# EAGLE schematic ds7_redraw (EAGLE 8.5.1)
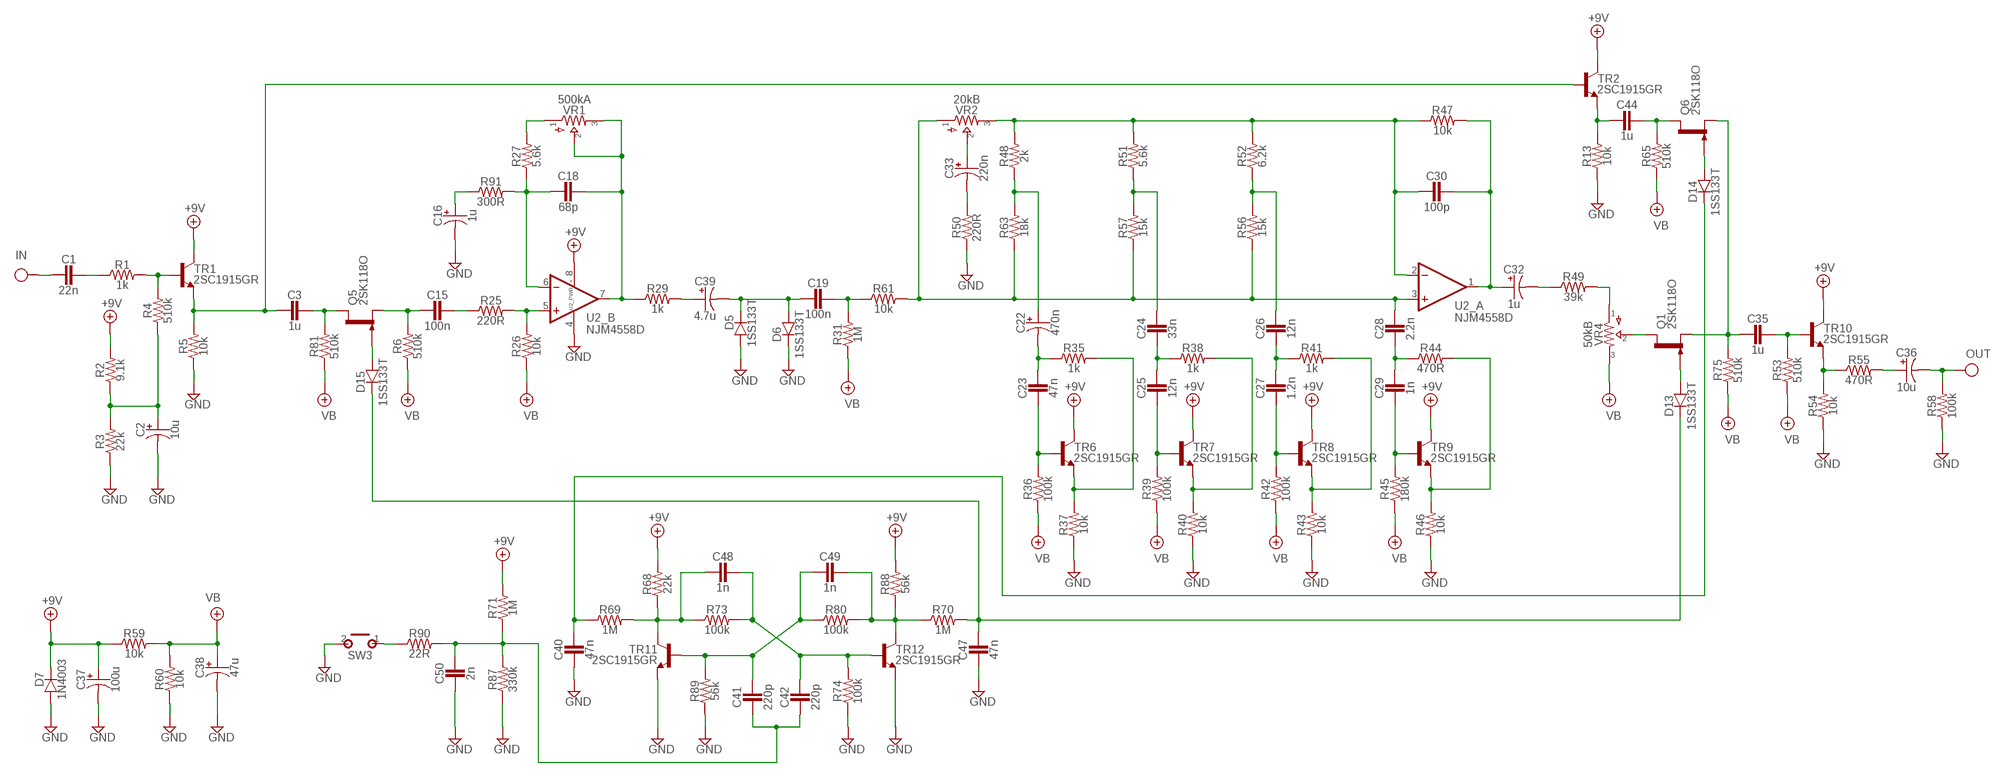
[diagram p0: schematic, sheet 1]

## Parts
C1  22n  CER/FILMBOX.1  [BOX_SMALL]
C2  10u  0400  [040_020]
C3  1u  CER/FILMBOX.1  [BOX_SMALL]
C15  100n  CER/FILMBOX.1  [BOX_SMALL]
C16  1u  0400  [040_020]
C18  68p  CER/FILMBOX.1  [BOX_SMALL]
C19  100n  CER/FILMBOX.1  [BOX_SMALL]
C22  470n  0400  [040_020]
C23  47n  CER/FILMBOX.1  [BOX_SMALL]
C24  33n  CER/FILMBOX.1  [BOX_SMALL]
C25  12n  CER/FILMBOX.1  [BOX_SMALL]
C26  12n  CER/FILMBOX.1  [BOX_SMALL]
C27  1.2n  CER/FILMBOX.1  [BOX_SMALL]
C28  2.2n  CER/FILMBOX.1  [BOX_SMALL]
C29  1n  CER/FILMBOX.1  [BOX_SMALL]
C30  100p  CER/FILMBOX.1  [BOX_SMALL]
C32  1u  0400  [040_020]
C33  220n  0400  [040_020]
C35  1u  CER/FILMBOX.1  [BOX_SMALL]
C36  10u  0400  [040_020]
C37  100u  0400  [040_020]
C38  47u  0400  [040_020]
C39  4.7u  0400  [040_020]
C40  47n  CER/FILMBOX.1  [BOX_SMALL]
C41  220p  CER/FILMBOX.1  [BOX_SMALL]
C42  220p  CER/FILMBOX.1  [BOX_SMALL]
C44  1u  CER/FILMBOX.1  [BOX_SMALL]
C47  47n  CER/FILMBOX.1  [BOX_SMALL]
C48  1n  CER/FILMBOX.1  [BOX_SMALL]
C49  1n  CER/FILMBOX.1  [BOX_SMALL]
C50  2n  CER/FILMBOX.1  [BOX_SMALL]
D5  1SS133T  DO41.2  [DO41-2]
D6  1SS133T  DO41.2  [DO41-2]
D7  1N4003  DO41.2  [DO41-2]
D13  1SS133T  DO41.2  [DO41-2]
D14  1SS133T  DO41.2  [DO41-2]
D15  1SS133T  DO41.2  [DO41-2]
Q1  2SK118O  2N5457  [TO92-]
Q5  2SK118O  2N5457  [TO92-]
Q6  2SK118O  2N5457  [TO92-]
R1  1k  R_.3B  [R0207/3]
R2  9.1k  R_.3B  [R0207/3]
R3  22k  R_.3B  [R0207/3]
R4  510k  R_.3B  [R0207/3]
R5  10k  R_.3B  [R0207/3]
R6  510k  R_.3B  [R0207/3]
R13  10k  R_.3B  [R0207/3]
R25  220R  R_.3B  [R0207/3]
R26  10k  R_.3B  [R0207/3]
R27  5.6k  R_.3B  [R0207/3]
R29  1k  R_.3B  [R0207/3]
R31  1M  R_.3B  [R0207/3]
R35  1k  R_.3B  [R0207/3]
R36  100k  R_.3B  [R0207/3]
R37  10k  R_.3B  [R0207/3]
R38  1k  R_.3B  [R0207/3]
R39  100k  R_.3B  [R0207/3]
R40  10k  R_.3B  [R0207/3]
R41  1k  R_.3B  [R0207/3]
R42  100k  R_.3B  [R0207/3]
R43  10k  R_.3B  [R0207/3]
R44  470R  R_.3B  [R0207/3]
R45  180k  R_.3B  [R0207/3]
R46  10k  R_.3B  [R0207/3]
R47  10k  R_.3B  [R0207/3]
R48  2k  R_.3B  [R0207/3]
R49  39k  R_.3B  [R0207/3]
R50  220R  R_.3B  [R0207/3]
R51  5.6k  R_.3B  [R0207/3]
R52  6.2k  R_.3B  [R0207/3]
R53  510k  R_.3B  [R0207/3]
R54  10k  R_.3B  [R0207/3]
R55  470R  R_.3B  [R0207/3]
R56  15k  R_.3B  [R0207/3]
R57  15k  R_.3B  [R0207/3]
R58  100k  R_.3B  [R0207/3]
R59  10k  R_.3B  [R0207/3]
R60  10k  R_.3B  [R0207/3]
R61  10k  R_.3B  [R0207/3]
R63  18k  R_.3B  [R0207/3]
R65  510k  R_.3B  [R0207/3]
R68  22k  R_.3B  [R0207/3]
R69  1M  R_.3B  [R0207/3]
R70  1M  R_.3B  [R0207/3]
R71  1M  R_.3B  [R0207/3]
R73  100k  R_.3B  [R0207/3]
R74  100k  R_.3B  [R0207/3]
R75  510k  R_.3B  [R0207/3]
R80  100k  R_.3B  [R0207/3]
R81  510k  R_.3B  [R0207/3]
R87  330k  R_.3B  [R0207/3]
R88  56k  R_.3B  [R0207/3]
R89  56k  R_.3B  [R0207/3]
R90  22R  R_.3B  [R0207/3]
R91  300R  R_.3B  [R0207/3]
SW3  MOMENTARY  [SPST]
TR1  2SC1915GR  2SC828A  [TO92-]
TR2  2SC1915GR  2SC828A  [TO92-]
TR6  2SC1915GR  2SC828A  [TO92-]
TR7  2SC1915GR  2SC828A  [TO92-]
TR8  2SC1915GR  2SC828A  [TO92-]
TR9  2SC1915GR  2SC828A  [TO92-]
TR10  2SC1915GR  2SC828A  [TO92-]
TR11  2SC1915GR  2SC828A  [TO92-]
TR12  2SC1915GR  2SC828A  [TO92-]
U2  NJM4558D  DUALTH  [DIL0]
VR1  500kA  POTS16MM  [16MM]
VR2  20kB  POTS16MM  [16MM]
VR4  50kB  POTS16MM  [16MM]

## Nets
+9V: C37.+ D7.C R2.2 R59.1 R68.2 R71.2 R88.2 TR1.2(C) TR2.2(C) TR6.2(C) TR7.2(C) TR8.2(C) TR9.2(C) TR10.2(C) U2.8(_PWR:V+)
GND: C2.- C16.- C37.- C38.- C40.2 C47.2 C50.2 D5.A D6.C D7.A R3.1 R5.1 R13.1 R37.1 R40.1 R43.1 R46.1 R50.1 R54.1 R58.1 R60.1 R74.1 R87.1 R89.1 SW3.2(S) TR11.3(E) TR12.3(E) U2.4(_PWR:V-)
IN: C1.2
N$1: C1.1 R1.1
N$2: R1.2 R4.2 TR1.1(B)
N$3: C3.2 R5.2 TR1.3(E) TR2.1(B)
N$4: C2.+ R2.1 R3.2 R4.1
N$5: C3.1 Q5.3(D) R81.2
N$6: D15.A Q5.1(G)
N$7: C15.2 Q5.2(S) R6.2
N$8: C15.1 R25.1
N$9: R25.2 R26.2 U2.5(_B:+IN)
N$10: C18.2 R27.1 R91.2 U2.6(_B:-IN)
N$11: C18.1 R29.1 U2.7(_B:OUT) VR1.2 VR1.3
N$12: R27.2 VR1.1
N$13: C16.+ R91.1
N$14: C39.+ R29.2
N$15: C19.2 C39.- D5.C D6.A
N$16: C19.1 R31.2 R61.1
N$17: C28.1 R56.1 R57.1 R61.2 R63.1 U2.3(_A:+IN) VR2.1
N$18: C33.+ VR2.2
N$19: C33.- R50.2
N$20: C30.2 R47.1 R48.2 R51.2 R52.2 U2.2(_A:-IN) VR2.3
N$21: C22.+ R48.1 R63.2
N$22: C22.- C23.1 R35.1
N$23: C23.2 R36.2 TR6.1(B)
N$24: R35.2 R37.2 TR6.3(E)
N$27: C24.1 R51.1 R57.2
N$28: C24.2 C25.1 R38.1
N$29: C48.2 R68.1 R69.2 R73.1 TR11.2(C)
N$30: C25.2 R39.2 TR7.1(B)
N$31: C49.1 R70.1 R80.2 R88.1 TR12.2(C)
N$32: C41.1 C49.2 R80.1 R89.2 TR11.1(B)
N$33: R38.2 R40.2 TR7.3(E)
N$34: C42.1 C48.1 R73.2 R74.2 TR12.1(B)
N$35: C26.1 R52.1 R56.2
N$36: C41.2 C42.2 C50.1 R71.1 R87.2 R90.2
N$37: C26.2 C27.1 R41.1
N$38: R90.1 SW3.1(P)
N$39: C27.2 R42.2 TR8.1(B)
N$40: R41.2 R43.2 TR8.3(E)
N$41: C28.2 C29.1 R44.1
N$42: C29.2 R45.2 TR9.1(B)
N$43: R44.2 R46.2 TR9.3(E)
N$44: C32.- R49.1
N$45: C30.1 C32.+ R47.2 U2.1(_A:OUT)
N$46: R49.2 VR4.1
N$47: C44.2 R13.2 TR2.3(E)
N$48: C44.1 Q6.3(D) R65.2
N$50: D14.A Q6.1(G)
N$51: C35.2 Q1.2(S) Q6.2(S) R75.2
N$52: Q1.3(D) VR4.2
N$53: D13.A Q1.1(G)
N$54: C35.1 R53.2 TR10.1(B)
N$55: R54.2 R55.1 TR10.3(E)
N$56: C36.+ R55.2
N$57: C47.1 D13.C D15.C R70.2
N$58: C40.1 D14.C R69.1
OUT: C36.- R58.2
VB: C38.+ R6.1 R26.1 R31.1 R36.1 R39.1 R42.1 R45.1 R53.1 R59.2 R60.2 R65.1 R75.1 R81.1 VR4.3

## Library data of the parts
C1 C3 C15 C18 C19 C23-C30 C35 C40-C42 C44 C47-C50 = pedals-capacitors-film:CER/FILM: 47 - 120pF Xicon Ceramic Disc 2.5mm lead spacing
C2 C16 C22 C32 C33 C36-C39 = pedals-capacitors-elec:040
D5-D7 D13-D15 = pedals-diodes:DO41: DO-41 Package Diodes: 1N4001 - 1N40019 Zener Diodes: 1N4728 - 1N4764
Q1 Q5 Q6 = pedals-transistors:2N5457: N-CHANNEL JFET
R1-R6 R13 R25-R27 R29 R31 R35-R61 R63 R65 R68-R71 R73-R75 R80 R81 R87-R91 = pedals-resistors:R_
SW3 = pedals-switches:MOMENTARY
TR1 TR2 TR6-TR12 = pedals-transistors:2SC828A
U2 = pedals-integrated circuits:DUAL: OP AMP
VR1 VR2 VR4 = pedals-potentiometers:POTS